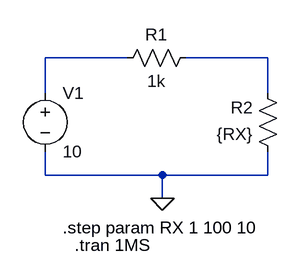
[diagram p0: schematic Draft4.asc]
Draft4.asc, the LTspice schematic file:
Version 4
SHEET 1 880 680
WIRE 160 128 48 128
WIRE 352 128 240 128
WIRE 48 176 48 128
WIRE 352 176 352 128
WIRE 48 288 48 256
WIRE 208 288 48 288
WIRE 352 288 352 256
WIRE 352 288 208 288
WIRE 208 320 208 288
FLAG 208 320 0
SYMBOL voltage 48 160 R0
WINDOW 123 0 0 Left 0
WINDOW 39 0 0 Left 0
SYMATTR InstName V1
SYMATTR Value 10
SYMBOL res 256 112 R90
WINDOW 0 0 56 VBottom 2
WINDOW 3 32 56 VTop 2
SYMATTR InstName R1
SYMATTR Value 1k
SYMBOL res 368 272 R180
WINDOW 0 36 76 Left 2
WINDOW 3 36 40 Left 2
SYMATTR InstName R2
SYMATTR Value {RX}
TEXT 72 360 Left 2 !.step param RX 1 100 10
TEXT 88 384 Left 2 !.tran 1MS

The netlist it stands for:
* Draft4.asc
V1 N001 0 10
R1 N002 N001 1k
R2 0 N002 {RX}
.step param RX 1 100 10
.tran 1MS
.backanno
.end